# Altium schematic sheet EVENTCTRL_TOP.SchDoc: TOP
size A3; Author: ZLY; DocumentNumber: 9321-E-1102-EMRT EVENT CONTROLLER ACQ; Revision: 1.0; SheetNumber: 1; SheetTotal: 6
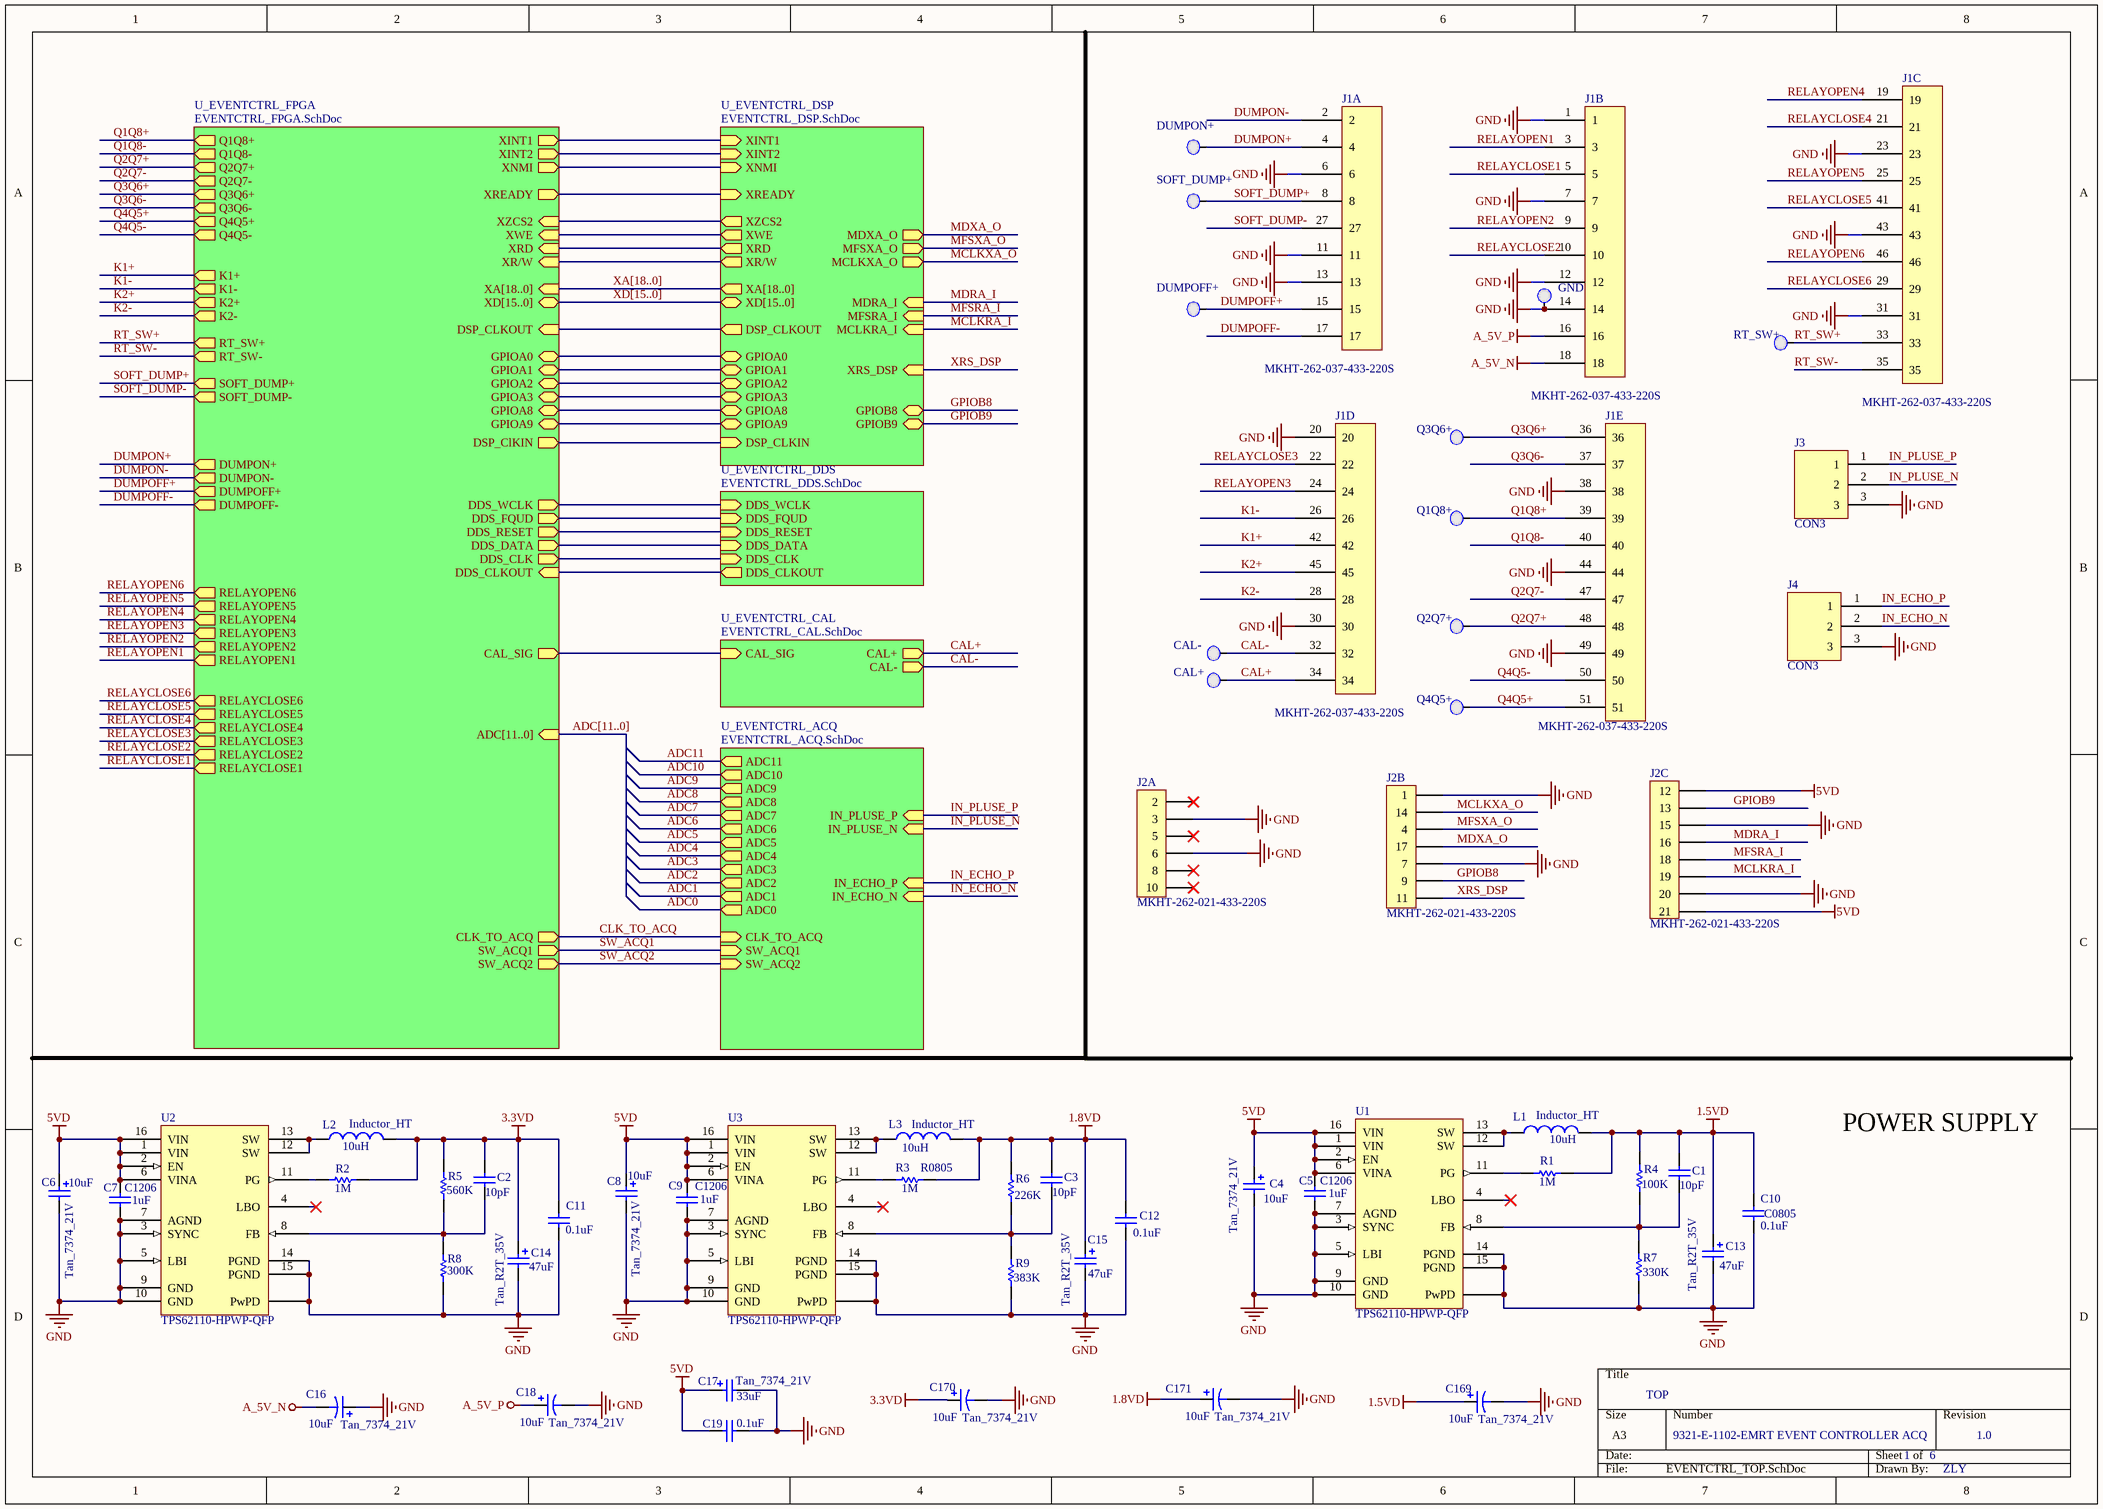
[diagram p0: EVENTCTRL_TOP.SchDoc]

## Parts
C1  value 10pF  [0805]  (hidden comment: C0805)
C2  value 10pF  [0805]  (hidden comment: C0805)
C3  value 10pF  [0805]  (hidden comment: C0805)
C4  Tan_7374_21V  value 10uF  [7343]
C5  C1206  value 1uF  [1206]
C6  Tan_7374_21V  value 10uF  [7343]
C7  C1206  value 1uF  [1206]
C8  Tan_7374_21V  value 10uF  [7343]
C9  C1206  value 1uF  [1206]
C10  C0805  value 0.1uF  [0805]
C11  value 0.1uF  [0805]  (hidden comment: C0805)
C12  value 0.1uF  [0805]  (hidden comment: C0805)
C13  Tan_R2T_35V  value 47uF  [7343]
C14  Tan_R2T_35V  value 47uF  [7343]
C15  Tan_R2T_35V  value 47uF  [7343]
C16  Tan_7374_21V  value 10uF  [7343]
C17  Tan_7374_21V  value 33uF  [7343]
C18  Tan_7374_21V  value 10uF  [7343]
C19  value 0.1uF  [0805]  (hidden comment: C0805)
C169  Tan_7374_21V  value 10uF  [7343]
C170  Tan_7374_21V  value 10uF  [7343]
C171  Tan_7374_21V  value 10uF  [7343]
CAL+  TP  [TPA]  (value not drawn)
CAL-  TP  [TPA]  (value not drawn)
DUMPOFF+  TP  [TPA]  (value not drawn)
DUMPON+  TP  [TPA]  (value not drawn)
GND  TP  [TPA]  (value not drawn)
J1  MKHT-262-037-433-220S  [MKHT-262-037-433-220S-51]  (parts A,B,C,D,E of 5)
J2  MKHT-262-021-433-220S  [AIRBORN_21]  (parts A,B,C of 3)
J3  CON3  [HEAT3]
J4  CON3  [HEAT3]
L1  Inductor_HT  value 10uH  [Inductor_HT]
L2  Inductor_HT  value 10uH  [Inductor_HT]
L3  Inductor_HT  value 10uH  [Inductor_HT]
Q1Q8+  TP  [TPA]  (value not drawn)
Q2Q7+  TP  [TPA]  (value not drawn)
Q3Q6+  TP  [TPA]  (value not drawn)
Q4Q5+  TP  [TPA]  (value not drawn)
R1  value 1M  [R0805]  (hidden comment: R0805)
R2  value 1M  [R0805]  (hidden comment: R0805)
R3  R0805  value 1M  [R0805]
R4  value 100K  [R0805]  (hidden comment: R0805)
R5  value 560K  [R0805]  (hidden comment: R0805)
R6  value 226K  [R0805]  (hidden comment: R0805)
R7  value 330K  [R0805]  (hidden comment: R0805)
R8  value 300K  [R0805]  (hidden comment: R0805)
R9  value 383K  [R0805]  (hidden comment: R0805)
RT_SW+  TP  [TPA]  (value not drawn)
SOFT_DUMP+  TP  [TPA]  (value not drawn)
U1  TPS62110-HPWP-QFP  [PWP16]
U2  TPS62110-HPWP-QFP  [PWP16]
U3  TPS62110-HPWP-QFP  [PWP16]

## Sub-sheets
U_EVENTCTRL_ACQ = EVENTCTRL_ACQ.SchDoc: IN_PLUSE_N (in), IN_PLUSE_P (in), IN_ECHO_N (in), IN_ECHO_P (in), SW_ACQ1 (in), SW_ACQ2 (in), CLK_TO_ACQ (in), ADC6 (out), ADC11 (out), ADC2 (out), ADC4 (out), ADC9 (out), ADC3 (out), ADC8 (out), ADC7 (out), ADC1 (out), ADC0 (out), ADC10 (out), ADC5 (out)
U_EVENTCTRL_CAL = EVENTCTRL_CAL.SchDoc: CAL_SIG (in), CAL+ (out), CAL- (out)
U_EVENTCTRL_DDS = EVENTCTRL_DDS.SchDoc: DDS_WCLK (in), DDS_FQUD (in), DDS_CLK (in), DDS_RESET (in), DDS_DATA (in), DDS_CLKOUT (out)
U_EVENTCTRL_DSP = EVENTCTRL_DSP.SchDoc: XZCS2 (out), XWE (out), XRD (out), XR/W (out), XREADY (in), DSP_CLKOUT (out), XINT1 (in), XINT2 (in), XNMI (in), GPIOA0 (bidir), GPIOA1 (bidir), GPIOA2 (bidir), GPIOA3 (bidir), MDXA_O (out), MFSXA_O (out), MCLKXA_O (out), MDRA_I (in), MFSRA_I (in), MCLKRA_I (in), XRS_DSP (in), XD[15..0] (bidir), XA[18..0] (out), GPIOB8 (bidir), GPIOB9 (bidir), GPIOA9 (bidir), GPIOA8 (bidir), DSP_CLKIN (in)
U_EVENTCTRL_FPGA = EVENTCTRL_FPGA.SchDoc: DDS_CLKOUT (in), XINT1 (out), XINT2 (out), XNMI (out), DDS_WCLK (out), DDS_FQUD (out), DDS_DATA (out), DDS_RESET (out), DSP_CLKOUT (in), XWE (in), XRD (in), GPIOA0 (bidir), GPIOA1 (bidir), GPIOA2 (bidir), GPIOA3 (bidir), XR/W (in), XREADY (out), XD[15..0] (bidir), XA[18..0] (in), Q1Q8+ (out), Q1Q8- (out), Q2Q7+ (out), Q2Q7- (out), Q3Q6+ (out), Q3Q6- (out), Q4Q5+ (out), Q4Q5- (out), DUMPON+ (out), DUMPON- (out), K1+ (out), K1- (out), RT_SW+ (out), RT_SW- (out), DUMPOFF+ (out), DUMPOFF- (out), K2+ (out), K2- (out), SOFT_DUMP+ (out), SOFT_DUMP- (out), GPIOA8 (bidir), GPIOA9 (bidir), CAL_SIG (out), SW_ACQ2 (out), SW_ACQ1 (out), CLK_TO_ACQ (out), DDS_CLK (out), XZCS2 (in), ADC[11..0] (in), RELAYOPEN6 (out), RELAYCLOSE4 (out), RELAYCLOSE6 (out), RELAYOPEN4 (out), RELAYCLOSE5 (out), RELAYOPEN1 (out), RELAYCLOSE2 (out), RELAYOPEN5 (out), RELAYCLOSE1 (out), RELAYOPEN3 (out), RELAYCLOSE3 (out), RELAYOPEN2 (out), DSP_ClKIN (out)

## Nets
1.5VD: C1.2 C10.2 C13.1 C169.1 L1.2 R1.2 R4.2
1.8VD: C3.2 C12.2 C15.1 C171.1 L3.2 R3.2 R6.2
3.3VD: C2.2 C11.2 C14.1 C170.1 L2.2 R2.2 R5.2
5VD: C4.1 C5.2 C6.1 C7.2 C8.1 C9.2 C17.1 C19.2 J2.12 J2.21 U1.1(VIN) U1.2(EN) U1.6(VINA) U1.16(VIN) U2.1(VIN) U2.2(EN) U2.6(VINA) U2.16(VIN) U3.1(VIN) U3.2(EN) U3.6(VINA) U3.16(VIN)
A_5V_N: C16.2 J1.18
A_5V_P: C18.1 J1.16
GND: C4.2 C5.1 C6.2 C7.1 C8.2 C9.1 C10.1 C11.1 C12.1 C13.2 C14.2 C15.2 C16.1 C17.2 C18.2 C19.1 C169.2 C170.2 C171.2 GND.1(TP) J1.1 J1.6 J1.7 J1.11 J1.12 J1.13 J1.14 J1.20 J1.23 J1.30 J1.31 J1.38 J1.43 J1.44 J1.49 J2.1 J2.3 J2.6 J2.7 J2.15 J2.20 J3.3 J4.3 R7.1 R8.1 R9.1 U1.3(SYNC) U1.5(LBI) U1.7(AGND) U1.9(GND) U1.10(GND) U1.14(PGND) U1.15(PGND) U1.PwPD U2.3(SYNC) U2.5(LBI) U2.7(AGND) U2.9(GND) U2.10(GND) U2.14(PGND) U2.15(PGND) U2.PwPD U3.3(SYNC) U3.5(LBI) U3.7(AGND) U3.9(GND) U3.10(GND) U3.14(PGND) U3.15(PGND) U3.PwPD
ADC0: sheet U_EVENTCTRL_ACQ/ADC0
ADC1: sheet U_EVENTCTRL_ACQ/ADC1
ADC2: sheet U_EVENTCTRL_ACQ/ADC2
ADC3: sheet U_EVENTCTRL_ACQ/ADC3
ADC4: sheet U_EVENTCTRL_ACQ/ADC4
ADC5: sheet U_EVENTCTRL_ACQ/ADC5
ADC6: sheet U_EVENTCTRL_ACQ/ADC6
ADC7: sheet U_EVENTCTRL_ACQ/ADC7
ADC8: sheet U_EVENTCTRL_ACQ/ADC8
ADC9: sheet U_EVENTCTRL_ACQ/ADC9
ADC10: sheet U_EVENTCTRL_ACQ/ADC10
ADC11: sheet U_EVENTCTRL_ACQ/ADC11
CAL+: CAL+.1(TP) J1.34 ; sheet U_EVENTCTRL_CAL/CAL+
CAL-: CAL-.1(TP) J1.32 ; sheet U_EVENTCTRL_CAL/CAL-
CLK_TO_ACQ: sheet U_EVENTCTRL_ACQ/CLK_TO_ACQ, sheet U_EVENTCTRL_FPGA/CLK_TO_ACQ
DUMPOFF+: DUMPOFF+.1(TP) J1.15 ; sheet U_EVENTCTRL_FPGA/DUMPOFF+
DUMPOFF-: J1.17 ; sheet U_EVENTCTRL_FPGA/DUMPOFF-
DUMPON+: DUMPON+.1(TP) J1.4 ; sheet U_EVENTCTRL_FPGA/DUMPON+
DUMPON-: J1.2 ; sheet U_EVENTCTRL_FPGA/DUMPON-
GPIOB8: J2.9 ; sheet U_EVENTCTRL_DSP/GPIOB8
GPIOB9: J2.13 ; sheet U_EVENTCTRL_DSP/GPIOB9
IN_ECHO_N: J4.2 ; sheet U_EVENTCTRL_ACQ/IN_ECHO_N
IN_ECHO_P: J4.1 ; sheet U_EVENTCTRL_ACQ/IN_ECHO_P
IN_PLUSE_N: J3.2 ; sheet U_EVENTCTRL_ACQ/IN_PLUSE_N
IN_PLUSE_P: J3.1 ; sheet U_EVENTCTRL_ACQ/IN_PLUSE_P
K1+: J1.42 ; sheet U_EVENTCTRL_FPGA/K1+
K1-: J1.26 ; sheet U_EVENTCTRL_FPGA/K1-
K2+: J1.45 ; sheet U_EVENTCTRL_FPGA/K2+
K2-: J1.28 ; sheet U_EVENTCTRL_FPGA/K2-
MCLKRA_I: J2.19 ; sheet U_EVENTCTRL_DSP/MCLKRA_I
MCLKXA_O: J2.14 ; sheet U_EVENTCTRL_DSP/MCLKXA_O
MDRA_I: J2.16 ; sheet U_EVENTCTRL_DSP/MDRA_I
MDXA_O: J2.17 ; sheet U_EVENTCTRL_DSP/MDXA_O
MFSRA_I: J2.18 ; sheet U_EVENTCTRL_DSP/MFSRA_I
MFSXA_O: J2.4 ; sheet U_EVENTCTRL_DSP/MFSXA_O
Q1Q8+: J1.39 Q1Q8+.1(TP) ; sheet U_EVENTCTRL_FPGA/Q1Q8+
Q1Q8-: J1.40 ; sheet U_EVENTCTRL_FPGA/Q1Q8-
Q2Q7+: J1.48 Q2Q7+.1(TP) ; sheet U_EVENTCTRL_FPGA/Q2Q7+
Q2Q7-: J1.47 ; sheet U_EVENTCTRL_FPGA/Q2Q7-
Q3Q6+: J1.36 Q3Q6+.1(TP) ; sheet U_EVENTCTRL_FPGA/Q3Q6+
Q3Q6-: J1.37 ; sheet U_EVENTCTRL_FPGA/Q3Q6-
Q4Q5+: J1.51 Q4Q5+.1(TP) ; sheet U_EVENTCTRL_FPGA/Q4Q5+
Q4Q5-: J1.50 ; sheet U_EVENTCTRL_FPGA/Q4Q5-
RELAYCLOSE1: J1.5 ; sheet U_EVENTCTRL_FPGA/RELAYCLOSE1
RELAYCLOSE2: J1.10 ; sheet U_EVENTCTRL_FPGA/RELAYCLOSE2
RELAYCLOSE3: J1.22 ; sheet U_EVENTCTRL_FPGA/RELAYCLOSE3
RELAYCLOSE4: J1.21 ; sheet U_EVENTCTRL_FPGA/RELAYCLOSE4
RELAYCLOSE5: J1.41 ; sheet U_EVENTCTRL_FPGA/RELAYCLOSE5
RELAYCLOSE6: J1.29 ; sheet U_EVENTCTRL_FPGA/RELAYCLOSE6
RELAYOPEN1: J1.3 ; sheet U_EVENTCTRL_FPGA/RELAYOPEN1
RELAYOPEN2: J1.9 ; sheet U_EVENTCTRL_FPGA/RELAYOPEN2
RELAYOPEN3: J1.24 ; sheet U_EVENTCTRL_FPGA/RELAYOPEN3
RELAYOPEN4: J1.19 ; sheet U_EVENTCTRL_FPGA/RELAYOPEN4
RELAYOPEN5: J1.25 ; sheet U_EVENTCTRL_FPGA/RELAYOPEN5
RELAYOPEN6: J1.46 ; sheet U_EVENTCTRL_FPGA/RELAYOPEN6
RT_SW+: J1.33 RT_SW+.1(TP) ; sheet U_EVENTCTRL_FPGA/RT_SW+
RT_SW-: J1.35 ; sheet U_EVENTCTRL_FPGA/RT_SW-
SOFT_DUMP+: J1.8 SOFT_DUMP+.1(TP) ; sheet U_EVENTCTRL_FPGA/SOFT_DUMP+
SOFT_DUMP-: J1.27 ; sheet U_EVENTCTRL_FPGA/SOFT_DUMP-
SW_ACQ1: sheet U_EVENTCTRL_ACQ/SW_ACQ1, sheet U_EVENTCTRL_FPGA/SW_ACQ1
SW_ACQ2: sheet U_EVENTCTRL_ACQ/SW_ACQ2, sheet U_EVENTCTRL_FPGA/SW_ACQ2
XRS_DSP: J2.11 ; sheet U_EVENTCTRL_DSP/XRS_DSP
NetC1_1: C1.1 R4.1 R7.2 U1.8(FB)
NetC2_1: C2.1 R5.1 R8.2 U2.8(FB)
NetC3_1: C3.1 R6.1 R9.2 U3.8(FB)
NetL1_1: L1.1 U1.12(SW) U1.13(SW)
NetL2_1: L2.1 U2.12(SW) U2.13(SW)
NetL3_1: L3.1 U3.12(SW) U3.13(SW)
NetR1_1: R1.1 U1.11(PG)
NetR2_1: R2.1 U2.11(PG)
NetR3_1: R3.1 U3.11(PG)
(unnamed): sheet U_EVENTCTRL_CAL/CAL_SIG, sheet U_EVENTCTRL_FPGA/CAL_SIG
(unnamed): sheet U_EVENTCTRL_DDS/DDS_WCLK, sheet U_EVENTCTRL_FPGA/DDS_WCLK
(unnamed): sheet U_EVENTCTRL_DDS/DDS_FQUD, sheet U_EVENTCTRL_FPGA/DDS_FQUD
(unnamed): sheet U_EVENTCTRL_DDS/DDS_CLK, sheet U_EVENTCTRL_FPGA/DDS_CLK
(unnamed): sheet U_EVENTCTRL_DDS/DDS_RESET, sheet U_EVENTCTRL_FPGA/DDS_RESET
(unnamed): sheet U_EVENTCTRL_DDS/DDS_DATA, sheet U_EVENTCTRL_FPGA/DDS_DATA
(unnamed): sheet U_EVENTCTRL_DDS/DDS_CLKOUT, sheet U_EVENTCTRL_FPGA/DDS_CLKOUT
(unnamed): sheet U_EVENTCTRL_DSP/XZCS2, sheet U_EVENTCTRL_FPGA/XZCS2
(unnamed): sheet U_EVENTCTRL_DSP/XWE, sheet U_EVENTCTRL_FPGA/XWE
(unnamed): sheet U_EVENTCTRL_DSP/XRD, sheet U_EVENTCTRL_FPGA/XRD
(unnamed): sheet U_EVENTCTRL_DSP/XR/W, sheet U_EVENTCTRL_FPGA/XR/W
(unnamed): sheet U_EVENTCTRL_DSP/XREADY, sheet U_EVENTCTRL_FPGA/XREADY
(unnamed): sheet U_EVENTCTRL_DSP/DSP_CLKOUT, sheet U_EVENTCTRL_FPGA/DSP_CLKOUT
(unnamed): sheet U_EVENTCTRL_DSP/XINT1, sheet U_EVENTCTRL_FPGA/XINT1
(unnamed): sheet U_EVENTCTRL_DSP/XINT2, sheet U_EVENTCTRL_FPGA/XINT2
(unnamed): sheet U_EVENTCTRL_DSP/XNMI, sheet U_EVENTCTRL_FPGA/XNMI
(unnamed): sheet U_EVENTCTRL_DSP/GPIOA0, sheet U_EVENTCTRL_FPGA/GPIOA0
(unnamed): sheet U_EVENTCTRL_DSP/GPIOA1, sheet U_EVENTCTRL_FPGA/GPIOA1
(unnamed): sheet U_EVENTCTRL_DSP/GPIOA2, sheet U_EVENTCTRL_FPGA/GPIOA2
(unnamed): sheet U_EVENTCTRL_DSP/GPIOA3, sheet U_EVENTCTRL_FPGA/GPIOA3
(unnamed): sheet U_EVENTCTRL_DSP/GPIOA9, sheet U_EVENTCTRL_FPGA/GPIOA9
(unnamed): sheet U_EVENTCTRL_DSP/GPIOA8, sheet U_EVENTCTRL_FPGA/GPIOA8
(unnamed): sheet U_EVENTCTRL_DSP/DSP_CLKIN, sheet U_EVENTCTRL_FPGA/DSP_ClKIN

Not connected (* = marked no-connect by the designer): J2 2* 5* 8* 10*; U1 4(LBO)*; U2 4(LBO)*; U3 4(LBO)*

## Buses and harness runs
bus ADC[11..0] = sheet U_EVENTCTRL_FPGA/ADC[11..0]
bus XA[18..0] = sheet U_EVENTCTRL_DSP/XA[18..0] = sheet U_EVENTCTRL_FPGA/XA[18..0]
bus XD[15..0] = sheet U_EVENTCTRL_DSP/XD[15..0] = sheet U_EVENTCTRL_FPGA/XD[15..0]

## Notes on the sheet
- POWER SUPPLY

## Library data of the parts
C1-C3 = Y20025162: Capacitor; 制造商型号: 0805D100J500P; parent: 01; 精度: ±5%; 描述: NOVACAP;0805D100J500P;10pF;30±ppm/℃;±5%;50V;C0G/NP0;200℃;CAP0805; 安装形式: SMT; 湿敏等级（回流焊峰值）: 0; 产品外形尺寸<长>: 0.080±0.008 in; 产品外形尺寸<宽>: 0.050±0.008 in; 产品外形尺寸<高>: 0.054 in; id: wt.part.WTPartMaster:1047283; state: APPROVED; folder: /Default/电容/0805D100J500P; Part Number: Y20025162; HelpURL: \\10.185.226.160\altium_center_db\DATASHEET\NOVACAP High Temperature Chip.pdf; Library Path: Cap.SchLib; Library Ref: Cap; Footprint Path: NOVACAP 0805.PcbLib; Footprint Ref: CAPS0805_54; pname: 0805D100J500P; Library Path 2: 0; Library Ref 2: 0; Footprint Path 2: 0; Footprint Ref 2: 0; Footprint Path 3: 0; Footprint Ref 3: 0
C4 C6 C8 = Y20024815: Polarized Capacitor; 制造商型号: T499C106K025AT; parent: 01; 精度: ±10%; 描述: KEMET;T499C106K025AT;10uF;±10%;25V;175℃;CAP2312; 安装形式: SMT; 湿敏等级（回流焊峰值）: 0; 产品外形尺寸<长>: 3.2±0.30 mm; 产品外形尺寸<宽>: 6.0±0.30 mm; 产品外形尺寸<高>: 2.5±0.30 mm; id: wt.part.WTPartMaster:1056571; state: APPROVED; folder: /Default/电容/T499C106K025AT; 耐压值: 21V; Part Number: Y20024815; HelpURL: \\10.185.226.160\altium_center_db\DATASHEET\KEMET T498&T499ns.pdf; Library Path: Cap Pol.SchLib; Library Ref: Cap Pol; Footprint Path: KEMET T499-C.PcbLib; Footprint Ref: CAPSP_2q2312_110; pname: T499C106K025AT; Library Path 2: 0; Library Ref 2: 0; Footprint Path 2: 0; Footprint Ref 2: 0; Footprint Path 3: 0; Footprint Ref 3: 0
C5 C7 C9 = Y20024113: Capacitor; 制造商型号: C1206C105K5RAC; parent: 01; 精度: ±10%; 描述: KEMET;C1206C105K5RAC;1uF;±10%;50V;X7R;125℃;CAP1206 MSL1; 安装形式: SMT; 湿敏等级（回流焊峰值）: MSL1; 产品外形尺寸<长>: 3.2±0.2 mm; 产品外形尺寸<宽>: 1.6±0.2 mm; 产品外形尺寸<高>: 1.0±0.1 mm; Library Path 2: 0; id: wt.part.WTPartMaster:1055130; state: APPROVED; folder: /Default/电容/C1206C105K5RAC; Part Number: Y20024113; HelpURL: \\10.185.226.160\altium_center_db\DATASHEET\KEMET X7R Dielectric(Commercial Grade).pdf; Library Path: Cap.SchLib; Library Ref: Cap; Footprint Path: KEMET C1206_43.PcbLib; Footprint Ref: CAPS1206_43; pname: C1206C105K5RAC; Library Ref 2: 0; Footprint Path 2: 0; Footprint Ref 2: 0; Footprint Path 3: 0; Footprint Ref 3: 0
C10-C12 C19 = Y20025084: Capacitor; 制造商型号: VJ0805H104KXA; parent: 01; 精度: ±10%; 描述: VISHAY;VJ0805H104KXA;0.1uF;±10%;50V;X8R;150℃;CAP0805; 安装形式: SMT; 湿敏等级（回流焊峰值）: 0; 产品外形尺寸<长>: 0.079±0.008 in; 产品外形尺寸<宽>: 0.049±0.008 in; 产品外形尺寸<高>: 0.057 in; id: wt.part.WTPartMaster:1053152; state: APPROVED; folder: /Default/电容/VJ0805H104KXA; Part Number: Y20025084; HelpURL: \\10.185.226.160\altium_center_db\DATASHEET\VISHAY VJ X8R.pdf; Library Path: Cap.SchLib; Library Ref: Cap; Footprint Path: VISHAY VJ0805_57.PcbLib; Footprint Ref: CAPS0805_57; pname: VJ0805H104KXA; Library Path 2: 0; Library Ref 2: 0; Footprint Path 2: 0; Footprint Ref 2: 0; Footprint Path 3: 0; Footprint Ref 3: 0
C13 C14 = Y20024816: Polarized Capacitor; 制造商型号: T499D476K016AT; parent: 01; 精度: ±10%; 描述: KEMET;T499D476K016AT;47uF;±10%;16V;175℃;CAP2917; 安装形式: SMT; 湿敏等级（回流焊峰值）: 0; 产品外形尺寸<长>: 7.3±0.30 mm; 产品外形尺寸<宽>: 4.3±0.30 mm; 产品外形尺寸<高>: 2.8±0.30 mm; id: wt.part.WTPartMaster:1056620; state: APPROVED; folder: /Default/电容/T499D476K016AT; Part Number: Y20024816; HelpURL: \\10.185.226.160\altium_center_db\DATASHEET\KEMET T498&T499ns.pdf; Library Path: Cap Pol.SchLib; Library Ref: Cap Pol; Footprint Path: KEMET T499-D.PcbLib; Footprint Ref: CAPSP_2q2917_122; pname: T499D476K016AT; Library Path 2: 0; Library Ref 2: 0; Footprint Path 2: 0; Footprint Ref 2: 0; Footprint Path 3: 0; Footprint Ref 3: 0
  C14: Footprint: R2T
C15 = Y20024816: Polarized Capacitor; 制造商型号: T499D476K016AT; parent: 01; 精度: ±10%; 描述: KEMET;T499D476K016AT;47uF;±10%;16V;175℃;CAP2917; 安装形式: SMT; 湿敏等级（回流焊峰值）: 0; 产品外形尺寸<长>: 7.3±0.30 mm; 产品外形尺寸<宽>: 4.3±0.30 mm; 产品外形尺寸<高>: 2.8±0.30 mm; id: wt.part.WTPartMaster:1056620; state: APPROVED; folder: /Default/电容/T499D476K016AT; 耐压值: 35V; Part Number: Y20024816; HelpURL: \\10.185.226.160\altium_center_db\DATASHEET\KEMET T498&T499ns.pdf; Library Path: Cap Pol.SchLib; Library Ref: Cap Pol; Footprint Path: KEMET T499-D.PcbLib; Footprint Ref: CAPSP_2q2917_122; pname: T499D476K016AT; Library Path 2: 0; Library Ref 2: 0; Footprint Path 2: 0; Footprint Ref 2: 0; Footprint Path 3: 0; Footprint Ref 3: 0
C16 C18 C169-C171 = Cap Pol1: Polarized Capacitor (Radial); 耐压值: 21V
C17 = Y20028884: Polarized Capacitor; 制造商型号: 593D336X9025D2TE3; parent: 01; 精度: ±10%; 描述: VISHAY;593D336X9025D2TE3;33uF; ±10%;25V;125℃;CAP2917; 安装形式: SMT; 湿敏等级（回流焊峰值）: 0; 产品外形尺寸<长>: 7.3±0.3 mm; 产品外形尺寸<宽>: 4.3±0.3 mm; 产品外形尺寸<高>: 2.8±0.3 mm; id: wt.part.WTPartMaster:2265816; state: APPROVED; folder: /Default/电容/593D336X9025D2TE3; 耐压值: 35V; Part Number: Y20028884; HelpURL: \\10.185.226.160\altium_center_db\DATASHEET\VISHAY 593D.pdf; Library Path: Cap Pol.SchLib; Library Ref: Cap Pol; Footprint Path: VISHAY 593D.PcbLib; Footprint Ref: CAPSP_2q2917_122; pname: 593D336X9025D2TE3; Library Path 2: 0; Library Ref 2: 0; Footprint Path 2: 0; Footprint Ref 2: 0; Footprint Path 3: 0; Footprint Ref 3: 0
L1-L3 = Y20028214: Inductor-1; parent: 10; 描述: EPCOS;B82422H1103K000;10uH INDUCTOR SIMID 1210?H; 安装形式: SMT; 引脚数目: 2; 最低温度: 0°C; 产品外形尺寸<长>: 3.2 mm; 产品外形尺寸<宽>: 2.5 mm; 产品外形尺寸<高>: 2.2 mm; 主要参数: LR=10uH;IR=0.5A;RMAX=0.46Ω;fres,min=30MHz;Qmin=12;电感容差=±10%; pname: B82422H1103K; Library Path 2: 0; id: wt.part.WTPartMaster:1042867; state: APPROVED; folder: /lijun/Checked Out/B82422H1103K; Part Number: Y20028214; 制造商型号: B82422H1103K000; HelpURL: \\10.185.226.160\altium_center_db\DATASHEET\EPCOS B82422H.pdf; Library Path: B82422H1103K000.SchLib; Library Ref: B82422H1103K000; Footprint Path: EPCOS B82422H1103K000.PcbLib; Footprint Ref: INDS 1210-H_95; Library Ref 2: 0; Footprint Path 2: 0; Footprint Ref 2: 0; Footprint Path 3: 0; Footprint Ref 3: 0
R1-R9 = Res1: Resistor; Published: 8-Jun-2000; LatestRevisionDate: 17-Jul-2002; LatestRevisionNote: Re-released for DXP Platform.; PackageReference: AXIAL-0.3; Publisher: Altium Limited; PackageDescription: Axial Device, Thru-Hole; 2 Leads; 0.3 in Pin Spacing
U1-U3 = Y20033002: 安装形式: SMT; 产品外形尺寸<高>: 1.2mm; 产品外形尺寸<长>: 6.6mm; 产品外形尺寸<宽>: 5.1mm; 引脚数目: 16; 湿敏等级（回流焊峰值）: MSL2(260C); 描述: TI;TPS62110-HPWP;175℃;HTSSOP 16PINS;MSL2(260C); id: wt.part.WTPartMaster:8901760; folder: /Default/电源及电源管理/TPS62110HPWP; 主要参数: 17-V, 1.5-A, SYNCHRONOUS STEP-DOWN CONVERTER; state: APPROVED; parent: 13; Library Path 2: 0; Part Number: Y20033002; Library Ref: TPS62110-HPWP; Footprint Path: 0; HelpURL: \\10.185.226.160\altium_center_db\DATASHEET\TI TPS62110-HT.pdf; Footprint Ref: 0; Library Path: TPS62110-HT.SchLib; 制造商型号: TPS62110-HPWP; pname: TPS62110-HPWP; Library Ref 2: 0; Footprint Path 2: 0; Footprint Ref 2: 0; Footprint Path 3: 0; Footprint Ref 3: 0